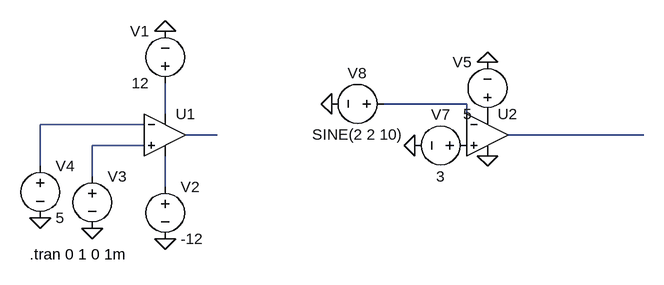
[diagram p0: schematic opamps.asc]
opamps.asc, the LTspice schematic file:
Version 4.1
SHEET 1 916 680
WIRE 640 128 512 128
WIRE 176 144 176 96
WIRE 144 160 -16 160
WIRE 640 160 640 128
WIRE 256 176 208 176
WIRE 912 176 704 176
WIRE 144 192 64 192
WIRE -16 224 -16 160
WIRE 64 240 64 192
WIRE 176 256 176 208
FLAG 176 16 0
FLAG 176 336 0
FLAG 64 320 0
FLAG -16 304 0
FLAG 672 64 0
FLAG 560 192 0
FLAG 432 128 0
FLAG 672 208 0
SYMBOL OpAmps\\UniversalOpAmp2 176 176 R0
SYMATTR InstName U1
SYMBOL voltage 176 112 R180
WINDOW 0 24 96 Left 2
WINDOW 3 24 16 Left 2
WINDOW 123 0 0 Left 0
WINDOW 39 0 0 Left 0
SYMATTR InstName V1
SYMATTR Value 12
SYMBOL voltage 176 240 R0
WINDOW 123 0 0 Left 0
WINDOW 39 0 0 Left 0
SYMATTR InstName V2
SYMATTR Value -12
SYMBOL voltage 64 224 R0
WINDOW 3 24 96 Invisible 2
WINDOW 123 0 0 Left 0
WINDOW 39 0 0 Left 0
SYMATTR Value SINE(0 6 10)
SYMATTR InstName V3
SYMBOL voltage -16 208 R0
WINDOW 123 0 0 Left 0
WINDOW 39 0 0 Left 0
SYMATTR InstName V4
SYMATTR Value 5
SYMBOL OpAmps\\UniversalOpAmp2 672 176 R0
SYMATTR InstName U2
SYMBOL voltage 672 160 R180
WINDOW 0 24 96 Left 2
WINDOW 3 24 16 Left 2
WINDOW 123 0 0 Left 0
WINDOW 39 0 0 Left 0
SYMATTR InstName V5
SYMATTR Value 5
SYMBOL voltage 656 192 R90
WINDOW 0 -32 56 VBottom 2
WINDOW 3 32 56 VTop 2
WINDOW 123 0 0 Left 0
WINDOW 39 0 0 Left 0
SYMATTR InstName V7
SYMATTR Value 3
SYMBOL voltage 528 128 R90
WINDOW 0 -32 56 VBottom 2
WINDOW 3 32 56 VTop 2
WINDOW 123 0 0 Left 0
WINDOW 39 0 0 Left 0
SYMATTR InstName V8
SYMATTR Value SINE(2 2 10)
TEXT -32 360 Left 2 !.tran 0 1 0 1m

The netlist it stands for:
* opamps.asc
X§U1 N006 N003 N002 N007 N004 level2 Avol=1Meg GBW=10Meg Slew=10Meg Ilimit=25m Rail=0 Vos=0 En=0 Enk=0 In=0 Ink=0 Rin=500Meg  ; pins In+ In- V+ V- OUT
V1 N002 0 12
V2 N007 0 -12
V3 N006 0 SINE(0 6 10)
V4 N003 0 5
X§U2 P001 N001 P002 0 N005 level2 Avol=1Meg GBW=10Meg Slew=10Meg Ilimit=25m Rail=0 Vos=0 En=0 Enk=0 In=0 Ink=0 Rin=500Meg  ; pins In+ In- V+ V- OUT
V5 P002 0 5
V7 P001 0 3
V8 N001 0 SINE(2 2 10)
.tran 0 1 0 1m
.lib UniversalOpAmp2.lib
.backanno
.end